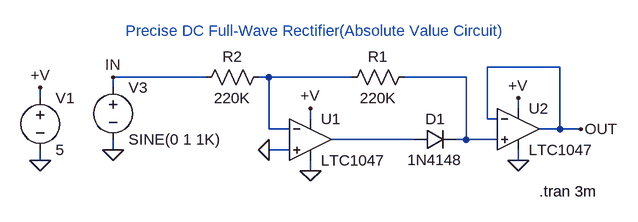
[diagram p0: schematic 1047.asc]
1047.asc, the LTspice schematic file:
Version 4
SHEET 1 896 680
WIRE 576 128 464 128
WIRE 32 144 -112 144
WIRE 128 144 112 144
WIRE 256 144 128 144
WIRE 432 144 336 144
WIRE -112 160 -112 144
WIRE -224 176 -224 160
WIRE 512 192 512 176
WIRE 192 208 192 192
WIRE 464 208 464 128
WIRE 480 208 464 208
WIRE 128 224 128 144
WIRE 160 224 128 224
WIRE 576 224 576 128
WIRE 576 224 544 224
WIRE 608 224 576 224
WIRE 352 240 224 240
WIRE 432 240 432 144
WIRE 432 240 416 240
WIRE 480 240 432 240
WIRE -112 256 -112 240
WIRE 160 256 128 256
WIRE -224 272 -224 256
WIRE 512 272 512 256
WIRE 192 288 192 272
FLAG -224 272 0
FLAG 192 192 +V
FLAG -224 160 +V
FLAG -112 256 0
FLAG 192 288 0
FLAG 512 176 +V
FLAG 512 272 0
FLAG 128 256 0
FLAG 608 224 OUT
FLAG -112 144 IN
SYMBOL voltage -224 160 R0
SYMATTR InstName V1
SYMATTR Value 5
SYMBOL res 352 128 R90
WINDOW 0 0 56 VBottom 2
WINDOW 3 32 56 VTop 2
SYMATTR InstName R1
SYMATTR Value 220K
SYMBOL res 128 128 R90
WINDOW 0 0 56 VBottom 2
WINDOW 3 32 56 VTop 2
SYMATTR InstName R2
SYMATTR Value 220K
SYMBOL voltage -112 144 R0
SYMATTR InstName V3
SYMATTR Value SINE(0 1 1K)
SYMBOL opamps\\LTC1047 192 176 R0
SYMATTR InstName U1
SYMBOL diode 352 256 R270
WINDOW 0 32 32 VTop 2
WINDOW 3 0 32 VBottom 2
SYMATTR InstName D1
SYMATTR Value 1N4148
SYMBOL opamps\\LTC1047 512 160 R0
SYMATTR InstName U2
TEXT 544 320 Left 2 !.tran 3m
TEXT 200 88 Bottom 2 ;Precise DC Full-Wave Rectifier(Absolute Value Circuit)

The netlist it stands for:
* 1047.asc
V1 +V 0 5
R1 N002 N001 220K
R2 N001 IN 220K
V3 IN 0 SINE(0 1 1K)
XU1 0 N001 +V 0 N003 LTC1047  ; pins In+ In- V+ V- OUT
D1 N003 N002 1N4148
XU2 N002 OUT +V 0 OUT LTC1047  ; pins In+ In- V+ V- OUT
.model D D
.lib standard.dio
.tran 3m
* Precise DC Full-Wave Rectifier(Absolute Value Circuit)
.backanno
.end